# EAGLE design muxi_control (EAGLE 6.1)
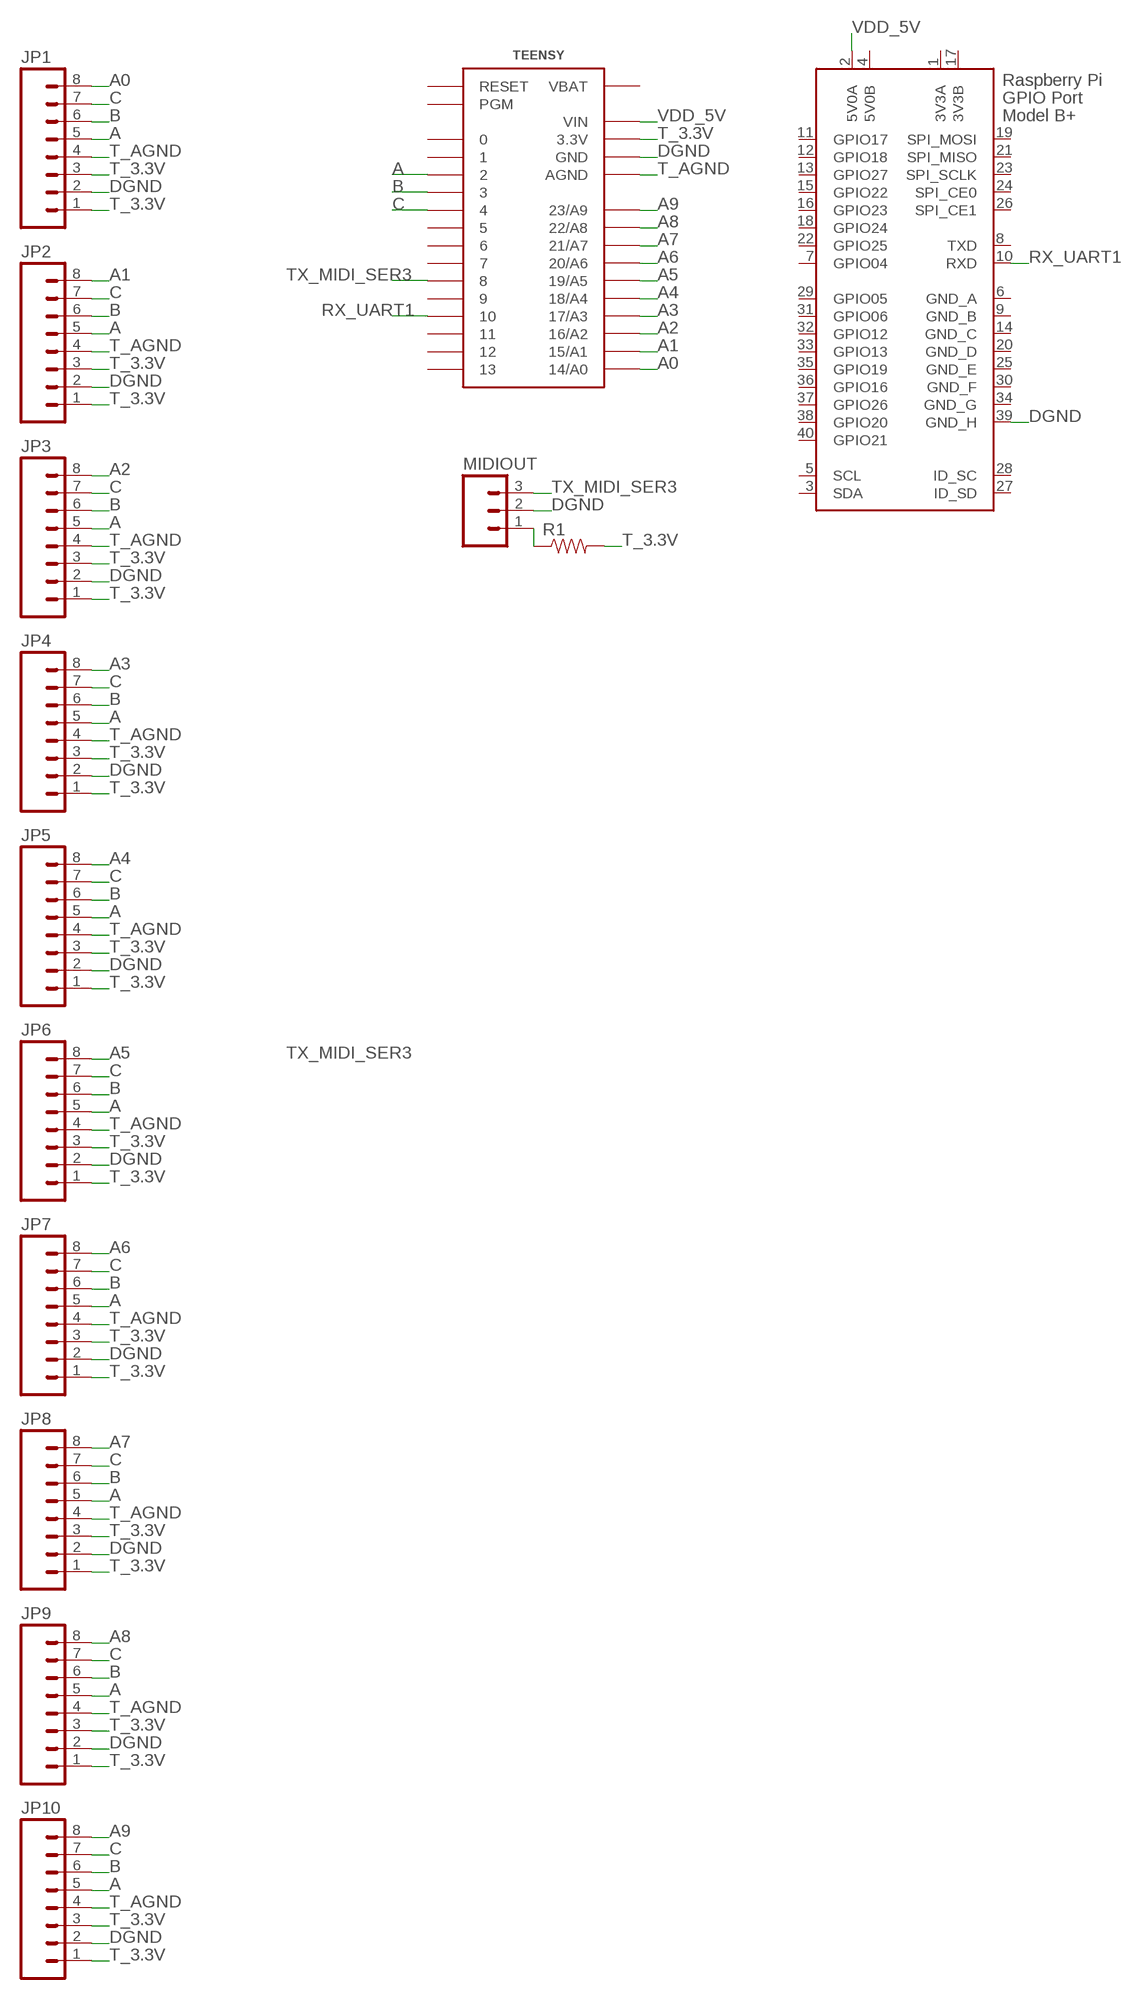
[diagram p0: schematic, sheet 1]

## Parts
JP1  M081X08  [1X08]
JP2  M081X08  [1X08]
JP3  M081X08  [1X08]
JP4  M081X08  [1X08]
JP5  M081X08  [1X08]
JP6  M081X08  [1X08]
JP7  M081X08  [1X08]
JP8  M081X08  [1X08]
JP9  M081X08  [1X08]
JP10  M081X08  [1X08]
MIDIOUT  M03PTH  [1X03]
R1  RESISTORAXIAL-0.3  [AXIAL-0.3]
TEENSY  TEENSY_3.0_BASIC  [TEENSY_3.0_BASIC]
X1  RASPI_BOARD_B+#_H  [RASPI_BOARD_B+HAT]

## Nets
A: JP1.5 JP2.5 JP3.5 JP4.5 JP5.5 JP6.5 JP7.5 JP8.5 JP9.5 JP10.5 TEENSY.2
A0: JP1.8 TEENSY.14/A0
A1: JP2.8 TEENSY.15/A1
A2: JP3.8 TEENSY.16/A2
A3: JP4.8 TEENSY.17/A3
A4: JP5.8 TEENSY.18/A4
A5: JP6.8 TEENSY.19/A5
A6: JP7.8 TEENSY.20/A6
A7: JP8.8 TEENSY.21/A7
A8: JP9.8 TEENSY.22/A8
A9: JP10.8 TEENSY.23/A9
B: JP1.6 JP2.6 JP3.6 JP4.6 JP5.6 JP6.6 JP7.6 JP8.6 JP9.6 JP10.6 TEENSY.3
C: JP1.7 JP2.7 JP3.7 JP4.7 JP5.7 JP6.7 JP7.7 JP8.7 JP9.7 JP10.7 TEENSY.4
DGND: JP1.2 JP2.2 JP3.2 JP4.2 JP5.2 JP6.2 JP7.2 JP8.2 JP9.2 JP10.2 MIDIOUT.2 TEENSY.GND TEENSY.GND1(GND) X1.39(GND_H)
N$3: MIDIOUT.1 R1.P$1
RX_UART1: TEENSY.10 X1.10(RXD)
T_3.3V: JP1.1 JP1.3 JP2.1 JP2.3 JP3.1 JP3.3 JP4.1 JP4.3 JP5.1 JP5.3 JP6.1 JP6.3 JP7.1 JP7.3 JP8.1 JP8.3 JP9.1 JP9.3 JP10.1 JP10.3 R1.P$2 TEENSY.3.3V TEENSY.3.3V1(3.3V)
T_AGND: JP1.4 JP2.4 JP3.4 JP4.4 JP5.4 JP6.4 JP7.4 JP8.4 JP9.4 JP10.4 TEENSY.AGND
TX_MIDI_SER3: MIDIOUT.3 TEENSY.8
VDD_5V: TEENSY.VIN X1.2(5V0A)
Unconnected: TEENSY.0 TEENSY.1 TEENSY.5 TEENSY.6 TEENSY.7 TEENSY.9 TEENSY.11 TEENSY.12 TEENSY.13 TEENSY.PGM TEENSY.RESET X1.3(SDA) X1.5(SCL) X1.7(GPIO04) X1.8(TXD) X1.11(GPIO17) X1.12(GPIO18) X1.13(GPIO27) X1.15(GPIO22) X1.16(GPIO23) X1.18(GPIO24) X1.19(SPI_MOSI) X1.21(SPI_MISO) X1.22(GPIO25) X1.23(SPI_SCLK) X1.24(SPI_CE0) X1.26(SPI_CE1) X1.27(ID_SD) X1.28(ID_SC) X1.29(GPIO05) X1.31(GPIO06) X1.32(GPIO12) X1.33(GPIO13) X1.35(GPIO19) X1.36(GPIO16) X1.37(GPIO26) X1.38(GPIO20) X1.40(GPIO21)

## Power pins joined to a net without a drawn wire
3V3A: X1.1(3V3A)
3V3B: X1.17(3V3B)
5V0B: X1.4(5V0B)
GND_A: X1.6(GND_A)
GND_B: X1.9(GND_B)
GND_C: X1.14(GND_C)
GND_D: X1.20(GND_D)
GND_E: X1.25(GND_E)
GND_F: X1.30(GND_F)
GND_G: X1.34(GND_G)
VBAT: TEENSY.VBAT

## Library data of the parts
JP1-JP10 = SparkFun-Connectors:M08: Header 8 Standard 8-pin 0.1" header. Use with straight break away headers (SKU : PRT-00116), right angle break away headers (PRT-00553), swiss pins (PRT-00743), machine pins (PRT-00117), and female headers (PRT-00115).
MIDIOUT = SparkFun-Connectors:M03: Header 3 Standard 3-pin 0.1" header. Use with straight break away headers (SKU : PRT-00116), right angle break away headers (PRT-00553), swiss pins (PRT-00743), machine pins (PRT-00117), and female headers (PRT-00115). Molex polarized connector foot print use with SKU : PRT-08232 with associated crimp pins and housings.
R1 = SparkFun-Resistors:RESISTOR: Resistor Basic schematic elements and footprints for 0603, 1206, and PTH resistors.
TEENSY = Teensy3.0:TEENSY_3.0_BASIC: Basic Teensy 3.0 with none of the 'inner' pins enabled. See '+4', 'AllAnalogPins", and 'AllPins' packages for additional pin holes, as needed.
X1 = raspberrypi_bastelstube_v13:RASPI_BOARD_B+#: Raspberry Pi GPIO connector with markings for the outer dimensions of the Raspberry Pi board model B+ with different sets of drill holes or mounting pads All pins connected

## Board
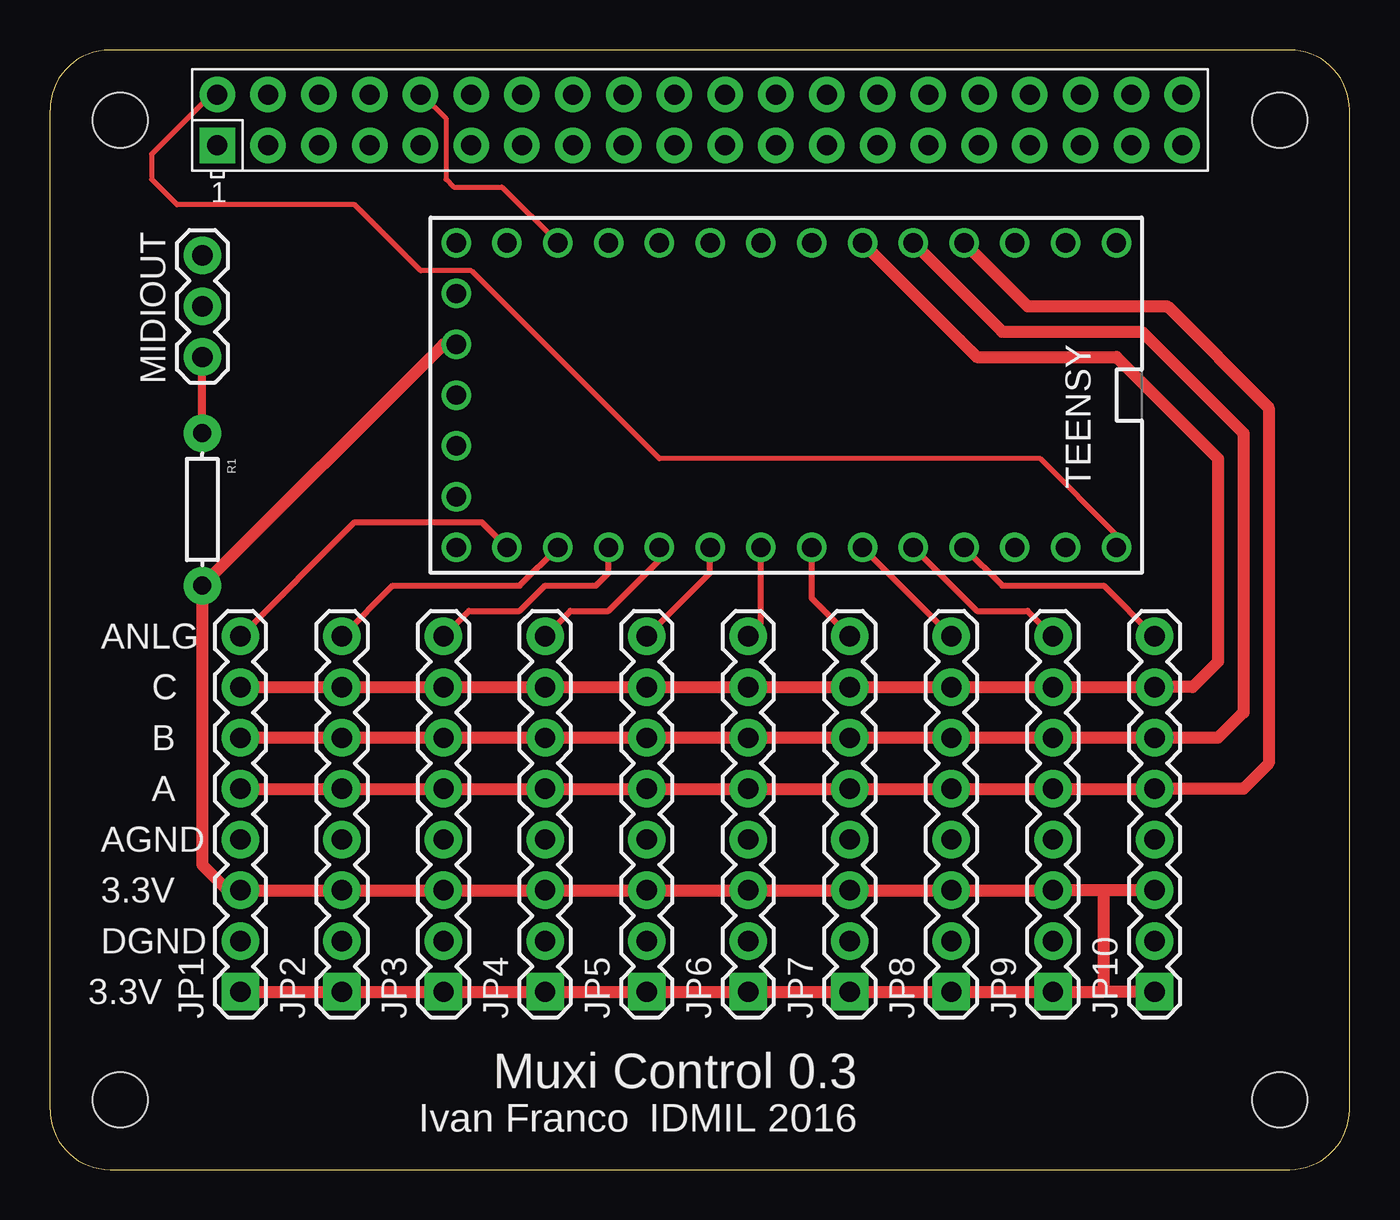
[diagram p1: board, top side]
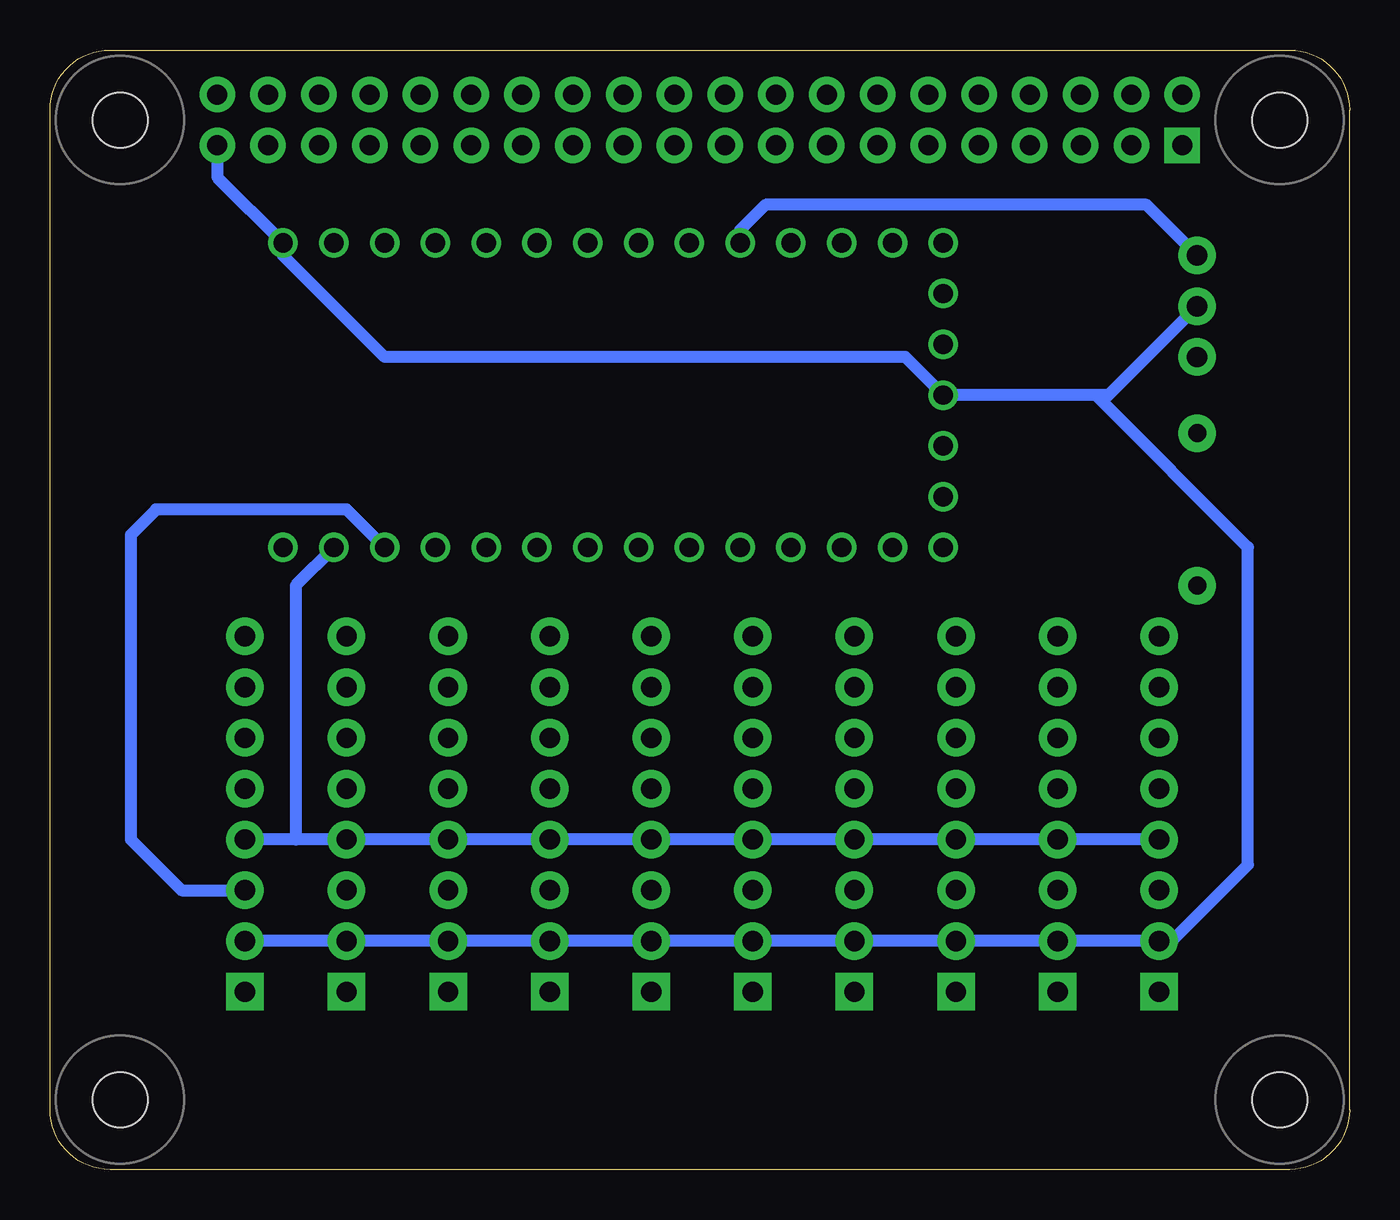
[diagram p2: board, bottom side, seen from below]

Size 65 x 56 mm. Coordinates in mm from the lower left corner, seen from the top.
Copper layers (1*16): Top 0.035mm / dielectric 1.5mm / Bottom 0.035mm
Design rules "dirt_cheap_dirty_boards.v1": minimum track width 5mil, minimum drill 12mil, track to track 5mil, track to pad 5mil, pad to pad 5mil, via to via 5mil, smd to smd 0mil, copper to edge 10mil, drill to drill 10mil, minimum pad ring 10mil, minimum via ring 6mil, stop-mask expansion 2mil, vias tented up to drill 25mil, thermal gap 10mil

### Footprints (pad centres in the part's own frame; a part is rotated, then mirrored left to right if it is on the bottom)
1X08 = drill 1.016 pad 1.88 square: 1 0,0 | drill 1.016 pad 1.88: 2 2.54,0; 3 5.08,0; 4 7.62,0; 5 10.16,0; 6 12.7,0; 7 15.24,0; 8 17.78,0
1X03 = drill 1.016 pad 1.88: 1 0,0; 2 2.54,0; 3 5.08,0
AXIAL-0.3 = drill 0.9 pad 1.88: P$1 -3.81,0; P$2 3.81,0
TEENSY_3.0_BASIC = drill 0.965: 0 -7.62,13.97; 1 -7.62,11.43; 2 -7.62,8.89; 3 -7.62,6.35; 3.3V 7.62,11.43; 3.3V1 -2.54,-16.51; 4 -7.62,3.81; 5 -7.62,1.27; 6 -7.62,-1.27; 7 -7.62,-3.81; 8 -7.62,-6.35; 9 -7.62,-8.89; 10 -7.62,-11.43; 11 -7.62,-13.97; 12 -7.62,-16.51; 13 7.62,-16.51; 14/A0 7.62,-13.97; 15/A1 7.62,-11.43; 16/A2 7.62,-8.89; 17/A3 7.62,-6.35; 18/A4 7.62,-3.81; 19/A5 7.62,-1.27; 20/A6 7.62,1.27; 21/A7 7.62,3.81; 22/A8 7.62,6.35; 23/A9 7.62,8.89; AGND 7.62,13.97; GND -7.62,16.51; GND1 0,-16.51; PGM 2.54,-16.51; RESET 5.08,-16.51; VBAT -5.08,-16.51; VIN 7.62,16.51
RASPI_BOARD_B+HAT = drill 1 pad 1.778 square: 1 8.37,51.23 | drill 1 pad 1.778: 2 8.37,53.77; 3 10.91,51.23; 4 10.91,53.77; 5 13.45,51.23; 6 13.45,53.77; 7 15.99,51.23; 8 15.99,53.77; 9 18.53,51.23; 10 18.53,53.77; 11 21.07,51.23; 12 21.07,53.77; 13 23.61,51.23; 14 23.61,53.77; 15 26.15,51.23; 16 26.15,53.77; 17 28.69,51.23; 18 28.69,53.77; 19 31.23,51.23; 20 31.23,53.77; 21 33.77,51.23; 22 33.77,53.77; 23 36.31,51.23; 24 36.31,53.77; 25 38.85,51.23; 26 38.85,53.77; 27 41.39,51.23; 28 41.39,53.77; 29 43.93,51.23; 30 43.93,53.77; 31 46.47,51.23; 32 46.47,53.77; 33 49.01,51.23; 34 49.01,53.77; 35 51.55,51.23; 36 51.55,53.77; 37 54.09,51.23; 38 54.09,53.77; 39 56.63,51.23; 40 56.63,53.77 | hole 2.75: 3.5,3.5; 3.5,52.5; 61.5,3.5; 61.5,52.5

### Placement (x,y rotation side)
JP1  9.53,8.89 90 top
JP2  14.61,8.89 90 top
JP3  19.68,8.89 90 top
JP4  24.77,8.89 90 top
JP5  29.84,8.89 90 top
JP6  34.92,8.89 90 top
JP7  40.01,8.89 90 top
JP8  45.09,8.89 90 top
JP9  50.16,8.89 90 top
JP10  55.24,8.89 90 top
MIDIOUT  7.62,40.64 90 top
R1  7.62,33.02 270 top
TEENSY  36.83,38.73 270 top
X1  0,0 0 top

### Tracks (layer width: path | path; a pad name or v marks a point on that pad's centre or on a via)
A
  Top 0.61: JP1.5 JP2.5 JP3.5 JP4.5 JP5.5 JP6.5 JP7.5 JP8.5 JP9.5 JP10.5 59.69,19.05 60.96,20.32 60.96,38.1 55.88,43.18 48.9,43.18 TEENSY.2
A0
  Top 0.305: JP1.8 15.24,32.38 21.59,32.38 TEENSY.14/A0
A1
  Top 0.305: JP2.8 17.14,29.21 23.5,29.21 TEENSY.15/A1
A2
  Top 0.305: JP3.8 20.95,27.94 23.5,27.94 24.77,29.21 27.3,29.21 27.94,29.84 TEENSY.16/A2
A3
  Top 0.305: JP4.8 26.04,27.94 27.94,27.94 30.48,30.48 TEENSY.17/A3
A4
  Top 0.305: JP5.8 33.02,29.84 TEENSY.18/A4
A5
  Top 0.305: JP6.8 35.56,27.3 TEENSY.19/A5
A6
  Top 0.305: JP7.8 38.1,28.57 TEENSY.20/A6
A7
  Top 0.305: TEENSY.21/A7 JP8.8
A8
  Top 0.305: TEENSY.22/A8 46.35,27.94 48.9,27.94 JP9.8
A9
  Top 0.305: TEENSY.23/A9 47.62,29.21 52.7,29.21 JP10.8
B
  Top 0.61: JP1.6 JP2.6 JP3.6 JP4.6 JP5.6 JP6.6 JP7.6 JP8.6 JP9.6 JP10.6 58.42,21.59 59.69,22.86 59.69,36.83 54.61,41.91 47.62,41.91 TEENSY.3
C
  Top 0.61: JP1.7 JP2.7 JP3.7 JP4.7 JP5.7 JP6.7 JP7.7 JP8.7 JP9.7 JP10.7 57.15,24.13 58.42,25.4 58.42,35.56 53.34,40.64 46.35,40.64 TEENSY.4
DGND
  Bottom 0.61: JP10.2 JP9.2 JP8.2 JP7.2 JP6.2 JP5.2 JP4.2 JP3.2 JP2.2 JP1.2 8.89,11.43 5.08,15.24 5.08,31.11 12.7,38.73 | MIDIOUT.2 12.06,38.73 12.7,38.73 | 12.7,38.73 TEENSY.GND1 22.23,40.64 48.26,40.64 53.34,45.72 TEENSY.GND 56.63,49.65 X1.39
N$3
  Top 0.406: R1.P$1 MIDIOUT.1
RX_UART1
  Top 0.254: X1.10 18.62,53.77 19.81,52.58 19.81,49.53 20.19,49.15 22.61,49.15 TEENSY.10
T_3.3V
  Top 0.61: JP1.1 JP2.1 JP3.1 JP4.1 JP5.1 JP6.1 JP7.1 JP8.1 JP9.1 52.7,8.89 | JP10.3 52.7,13.97 | 52.7,13.97 JP9.3 JP8.3 JP7.3 JP6.3 JP5.3 JP4.3 JP3.3 JP2.3 JP1.3 8.89,13.97 7.62,15.24 R1.P$2 19.68,41.27 TEENSY.3.3V1 | JP10.1 52.7,8.89 | 52.7,8.89 52.7,13.97
  Bottom 0.61: TEENSY.3.3V 50.16,33.02 59.69,33.02 60.96,31.75 60.96,16.51 58.42,13.97 JP10.3
T_AGND
  Bottom 0.61: JP1.4 JP2.4 JP3.4 JP4.4 JP5.4 JP6.4 JP7.4 JP8.4 JP9.4 52.7,16.51 | 52.7,16.51 JP10.4 | TEENSY.AGND 52.7,29.21 52.7,16.51
TX_MIDI_SER3
  Bottom 0.61: MIDIOUT.3 10.16,48.26 29.21,48.26 30.48,46.99 TEENSY.8
VDD_5V
  Top 0.254: TEENSY.VIN 53.34,31.75 49.53,35.56 30.48,35.56 21.08,44.96 18.54,44.96 15.24,48.26 6.35,48.26 5.08,49.53 5.08,50.8 8.05,53.77 X1.2

### Text on the board
tNames: ANLG | C | B | A | AGND | 3.3V | DGND | 3.3V | Muxi Control 0.3 | Ivan Franco | IDMIL 2016